# Altium schematic sheet POWER_SUPPLY.SchDoc
size A4
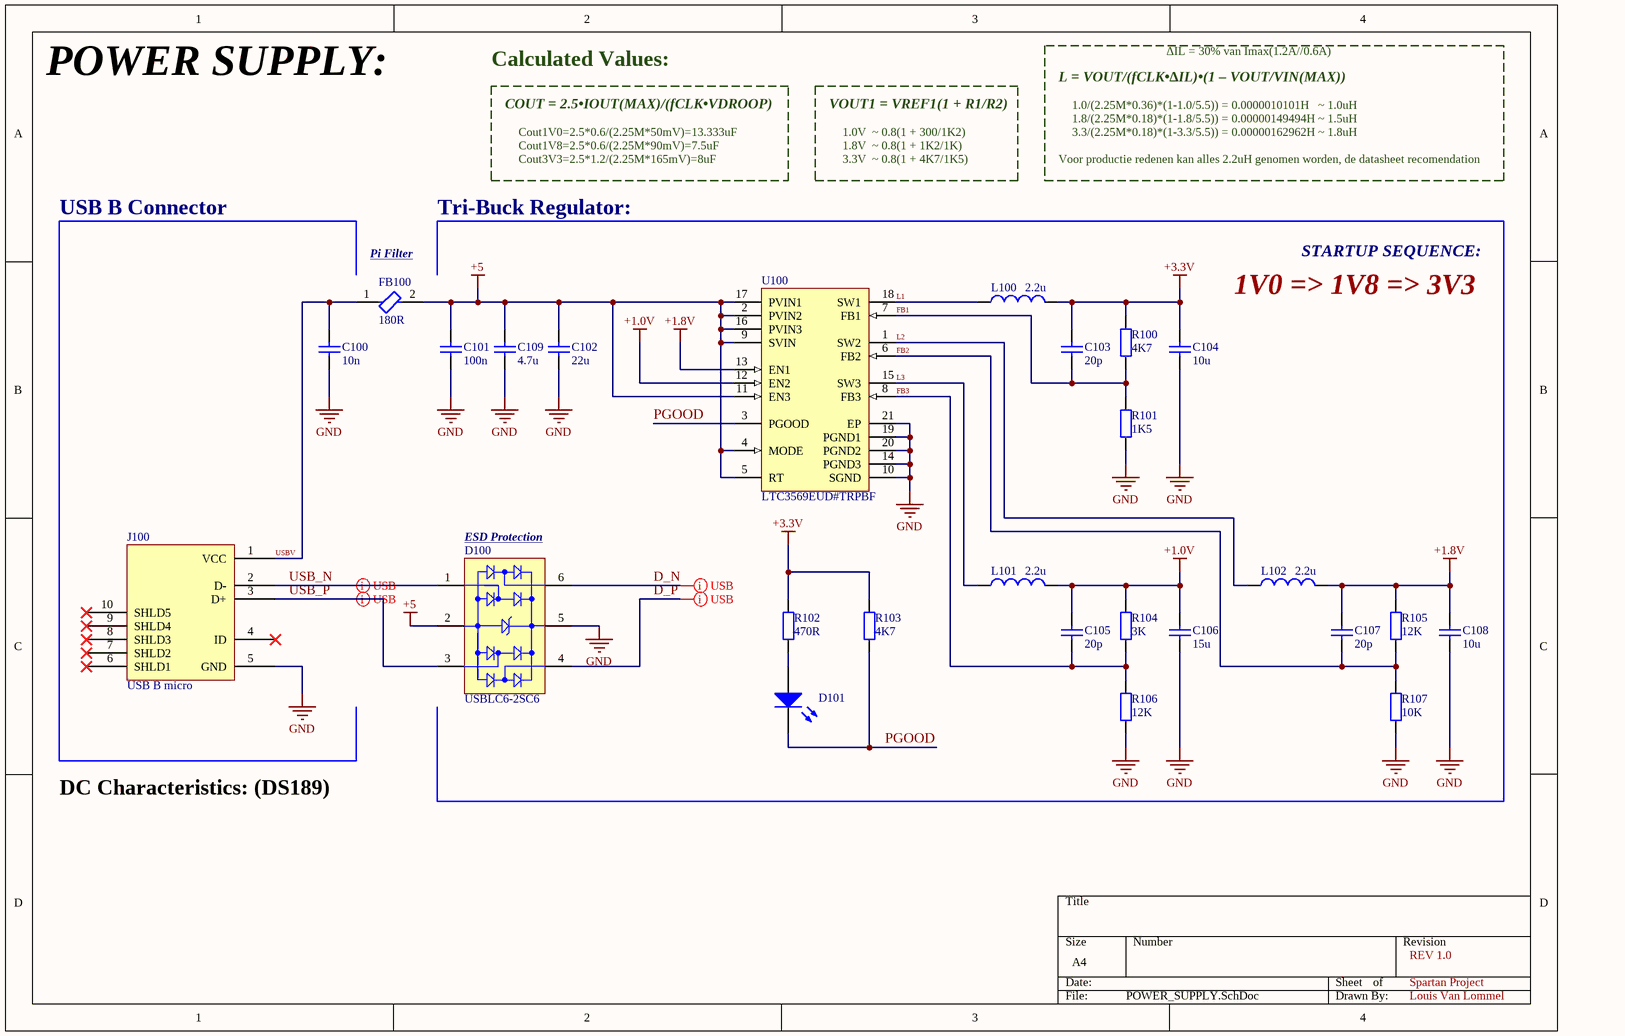
[diagram p0: POWER_SUPPLY.SchDoc]

## Parts
C100  10n  [CAP_0603]
C101  100n  [CAP_0603]
C102  22u  [CAP_1210]
C103  value 20p  [CAP_0603]  (hidden comment: 20pF)
C104  value 10u  [CAP_1210]  (hidden comment: 10uF)
C105  value 20p  [CAP_0603]  (hidden comment: 20pF)
C106  value 15u  [CAP_1210]  (hidden comment: 15uF)
C107  value 20p  [CAP_0603]  (hidden comment: 20pF)
C108  value 10u  [CAP_1210]  (hidden comment: 10uF)
C109  4.7u  [CAP_0603]
D100  USBLC6-2SC6  [STM-SOT23-6L_V]
D101  LED  [LED_0603]  (value not drawn)
FB100  180R  [CAP_0805]
J100  USB B micro  [USB Micro B]
L100  value 2.2u  [IND4x4mm]  (hidden comment: 2.2uH)
L101  value 2.2u  [IND4x4mm]  (hidden comment: 2.2uH)
L102  value 2.2u  [IND4x4mm]  (hidden comment: 2.2uH)
R100  4K7  [RES_0603]
R101  1K5  [RES_0603]
R102  value 470R  [RES_0603]  (hidden comment: 470)
R103  4K7  [RES_0603]
R104  3K  [RES_0603]
R105  12K  [RES_0603]
R106  12K  [RES_0603]
R107  10K  [RES_0603]
U100  LTC3569EUD#TRPBF  [LT-UD-20_N]

## Nets
+1.0V: C105.2 C106.2 L101.2 R104.2 U100.12(EN2)
+1.8V: C107.2 C108.2 L102.2 R105.2 U100.13(EN1)
+3.3V: C103.2 C104.2 L100.2 R100.2 R102.2 R103.2
+5: C101.2 C102.2 C109.2 D100.2(GND) FB100.2 U100.2(PVIN2) U100.4(MODE) U100.5(RT) U100.9(SVIN) U100.11(EN3) U100.16(PVIN3) U100.17(PVIN1)
GND: C100.1 C101.1 C102.1 C104.1 C106.1 C108.1 C109.1 D100.5(VBUS) J100.5(GND) R101.1 R106.1 R107.1 U100.10(SGND) U100.14(PGND3) U100.19(PGND1) U100.20(PGND2) U100.21(EP)
D_N: D100.6(I/O_4)
D_P: D100.4(I/O_3)
FB1: C103.1 R100.1 R101.2 U100.7(FB1)
FB2: C107.1 R105.1 R107.2 U100.6(FB2)
FB3: C105.1 R104.1 R106.2 U100.8(FB3)
L1: L100.1 U100.18(SW1)
L2: L102.1 U100.1(SW2)
L3: L101.1 U100.15(SW3)
PGOOD: D101.2(K) R103.1 U100.3(PGOOD)
USB_N: D100.1(I/O_1) J100.2(D-)
USB_P: D100.3(I/O_2) J100.3(D+)
USBV: C100.2 FB100.1 J100.1(VCC)
NetD101_1: D101.1(A) R102.1

Not connected (* = marked no-connect by the designer): J100 4(ID)* 6(SHLD1)* 7(SHLD2)* 8(SHLD3)* 9(SHLD4)* 10(SHLD5)*

## Layout directives
differential pair: D_N, D_P, USB_N, USB_P

## Notes on the sheet
- POWER SUPPLY:
- Calculated Values:
- COUT = 2.5•IOUT(MAX)/(fCLK•VDROOP)
- VOUT1 = VREF1(1 + R1/R2)
- L = VOUT/(fCLK•∆IL)•(1 – VOUT/VIN(MAX))
- 1.0/(2.25M*0.36)*(1-1.0/5.5)) = 0.0000010101H   ~ 1.0uH
- ∆IL = 30% van Imax(1.2A//0.6A)
- Cout3V3=2.5*1.2/(2.25M*165mV)=8uF
- Cout1V8=2.5*0.6/(2.25M*90mV)=7.5uF
- Cout1V0=2.5*0.6/(2.25M*50mV)=13.333uF
- 1.8V  ~ 0.8(1 + 1K2/1K)
- 3.3V  ~ 0.8(1 + 4K7/1K5)
- 1.0V  ~ 0.8(1 + 300/1K2)
- Voor productie redenen kan alles 2.2uH genomen worden, de datasheet recomendation
- 1.8/(2.25M*0.18)*(1-1.8/5.5)) = 0.00000149494H ~ 1.5uH
- 3.3/(2.25M*0.18)*(1-3.3/5.5)) = 0.00000162962H ~ 1.8uH
- USB B Connector
- Tri-Buck Regulator:
- (near FB100) Pi Filter <https://www.rfwireless-world.com/calculators/Pi-LC-Low-Pass-Filter-calculator.html>
- 1V0 => 1V8 => 3V3
- STARTUP SEQUENCE:
- (near D100) ESD Protection
- DC Characteristics: (DS189)
- REV 1.0
- Spartan Project
- Louis Van Lommel

## Library data of the parts
C100-C109 = Cap: Capacitor; Published: 8-Jun-2000; LatestRevisionDate: 17-Jul-2002; LatestRevisionNote: Re-released for DXP Platform.; PackageReference: RAD-0.3; Publisher: Altium Limited; PackageDescription: Radial Cap, Thru-Hole; 2 Leads; 0.3 in Pin Spacing
  C100: Value: 10n
  C101: Value: 100n
  C102: Value: 22u
  C109: Value: 4.7u
D100 = CMP-2000-05378-1: Very low capacitance ESD protection, 3.5 pF, -40 to 125 degC, 6-Pin SOT23, RoHS, Tape and Reel; Manufacturer: STMicroelectronics; Polarity: Uni-Directional; Clamping Voltage: 17V; Rad Hardened: No; Product Height (mm): 1.3mm; Leakage Current (Max): 0.15uA; Product Length (mm): 3.05mm; Number of Elements: 1; Peak Pulse Current: 5A; Configuration: Dual; Reverse Breakdown Voltage: 6V; Working Voltage (Max): 5V; Capacitance Value: 3.5pF; Suppressor Type: DiodeArrays; Product Depth (mm): 1.75mm; Test Current (It): 1mA; Package / Case: SOT-23; Operating Temperature Max Deg. C: 125C; Package Description: 6-Pin Small Outline Transistor, Body 2.925 x 1.625 mm, Pitch 0.95 mm; Package Reference: SOT23-6L; Datasheet Version: Rev. 5, 10/2011; Operating Temperature Min Deg. C: -40C; Mounting Style: SurfaceMount; Direction Type: Uni-Directional; Mounting: SurfaceMount; Pin Count: 6; Leakage Current: 0.15uA; Packaging: TapeandReel; Operating Temperature Classification: Automotive; Clamping Voltage (Max): 17V; Manufacturer URL: http://www.st.com/; Reverse Stand-off Voltage: 5V; Datasheet URL: http://www.st.com/st-web-ui/static/active/en/resource/technical/document/datasheet/CD00050750.pdf; Working Voltage: 5V; Operating Temp Range: -40Cto125C
D101 = LED0: Typical INFRARED GaAs LED; Published: 8-Jun-2000; LatestRevisionDate: 08-Jul-2005; LatestRevisionNote: Mech Layer 1 removed.; PackageReference: LED-0; Publisher: Altium Limited; PackageDescription: LED; 2 Leads
FB100 = Ferrite Bead: Chip Ferrite Bead, 0402, 1000Ω @ 100MHz, 0.65Ω, 25%, 300mA; DC Current: 200mA; Number of Circuits: 1; Shielding: Unshielded; Impedance: 1kR; DC Resistance (DCR): 650mR; DC Resistance-Max: 1R; Packaging: Tape and Reel; Case Code (Imperial): 0402; Military Standard: Not; Min Operating Temperature: -55°C; Width: 0.5mm; Tolerance: 25%; Material: Ferrite; Number of Lines: 1; Max Current Rating: 300mA; Depth: 0.55mm; Package Quantity: 1; Case/Package: 0402; Series: BLM15AG_SN; Case Code (Metric): 1005; Max Operating Temperature: 125°C; Lead Free: Lead Free; Test Frequency: 100MHz; RoHS Compliant: Yes; Radiation Hardening: No; Number of Pins: 2; Core Material: Ferrite; Current Rating: 300mA; Frequency: 100MHz; Max DC Current: 200mA; REACH SVHC: No SVHC; Length: 1mm; Termination: SMD/SMT; Height: 0.5mm
J100 = USB micro B
L100-L102 = Inductor: Code_IEC: 1005; Published: 8-Jun-2000; LatestRevisionDate: 29-May-2009; LatestRevisionNote: IPC-7351 Footprint Added.; PackageReference: 0402-A; Publisher: Altium Limited; PackageDescription: Chip Inductor; Code_JEITA: 0402
R100-R102 R104-R107 = Res2: Resistor; Published: 8-Jun-2000; LatestRevisionDate: 17-Jul-2002; LatestRevisionNote: Re-released for DXP Platform.; PackageReference: AXIAL-0.4; Publisher: Altium Limited; PackageDescription: Axial Device, Thru-Hole; 2 Leads; 0.4 in Pin Spacing
  R100: Value: 4K7
  R101: Value: 1K5
  R104: Value: 3K
  R105 R106: Value: 12K
  R107: Value: 10K
R103 = Res2: DNP R103; Published: 8-Jun-2000; LatestRevisionDate: 17-Jul-2002; LatestRevisionNote: Re-released for DXP Platform.; PackageReference: AXIAL-0.4; Publisher: Altium Limited; PackageDescription: Axial Device, Thru-Hole; 2 Leads; 0.4 in Pin Spacing; Value: 4K7; Parameter 1: *; Parameter 2: *
U100 = CMP-0492-02156-1: Triple Buck Regulator with 1.2 A and Two 600 mA Outputs and Individual Programmable References, 20-pin QFN (UD-20), -40 to 125 degC, Pb-Free, Tape and Reel; Manufacturer: Linear Technology; Frequency Adjust Range: 1MHz - 3MHz; Number of Outputs: 3; ComponentLink3URL: http://cds.linear.com/docs/en/packaging/QFN_20_05-08-1720.pdf; ComponentLink1Description: Manufacturer URL; ComponentLink2Description: Datasheet; PackageReference: UD-20; Mounting Technology: Surface Mount; Packing: Tape and Reel; PartNumber: LTC3569EUD#TRPBF; ComponentLink1URL: http://www.linear.com/; RoHS: TRUE; PackageVersion: Rev. A, 06/2010; ComponentLink2URL: http://cds.linear.com/docs/en/datasheet/3569fd.pdf; DatasheetVersion: Rev. D; PackageDescription: 20-Pin Plastic QFN, Body 3 x 3 mm, Pitch 0.4 mm; ComponentLink3Description: Package Specification